# EAGLE design FLCOS Projector Driver (EAGLE 9.0.1)

## Sheet 1 of 3
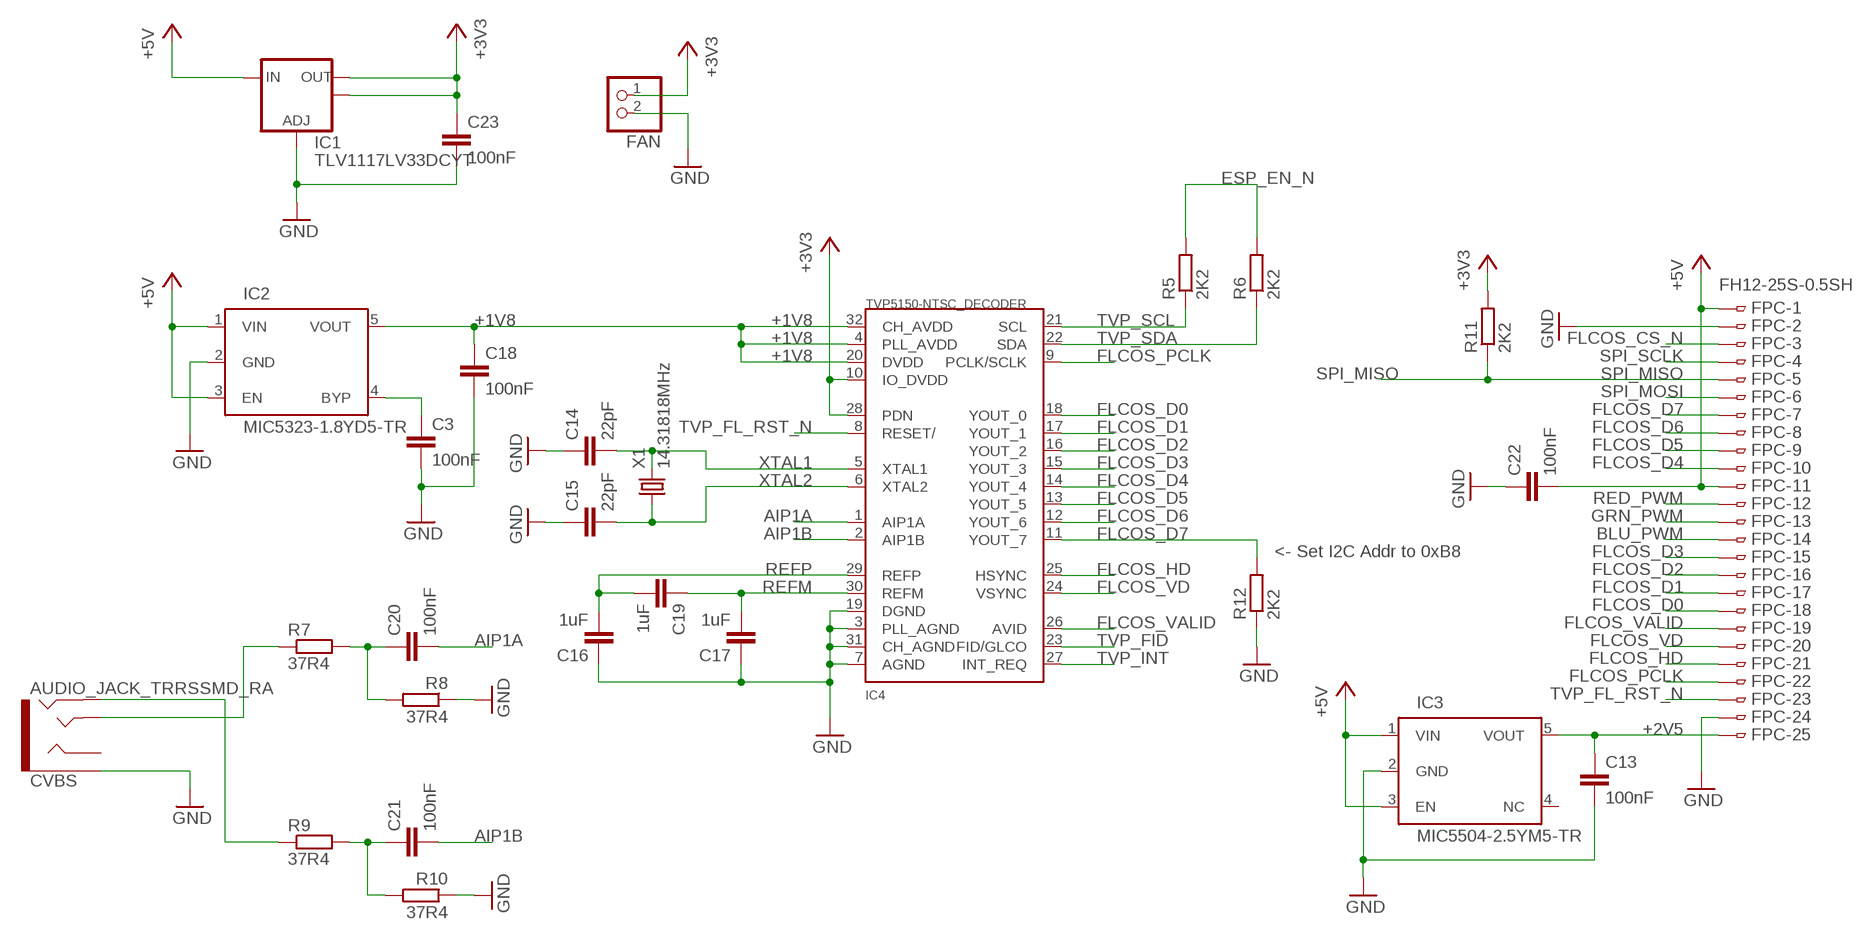
[diagram p0: schematic, sheet 1]

### Parts
C3  100nF  C-EUC0603  [C0603]
C13  100nF  C-EUC0603  [C0603]
C14  22pF  C-EUC0603  [C0603]
C15  22pF  C-EUC0603  [C0603]
C16  1uF  C-EUC0603  [C0603]
C17  1uF  C-EUC0603  [C0603]
C18  100nF  C-EUC0603  [C0603]
C19  1uF  C-EUC0603  [C0603]
C20  100nF  C-EUC0603  [C0603]
C21  100nF  C-EUC0603  [C0603]
C22  100nF  C-EUC0603  [C0603]
C23  100nF  C-EUC0603  [C0603]
CVBS  AUDIO_JACK_TRRSSMD_RA  [AUDIO_JACK_3.5MM_TRRS_SMD_RA]
FAN  JST_2PIN-THM  [JST-PH-2-THM]
FPC  FH12-25S-0.5SH  [FH12-25S-0.5SH]
IC1  TLV1117LV33DCYT  V_REG_LM1117SOT223  [SOT223]
IC2  MIC5323-1.8YD5-TR  [SOT23-5]
IC3  MIC5504-2.5YM5-TR  [SOT23-5]
IC4  TVP5150-NTSC_DECODER  [TQFP32-5MM]
R5  2K2  R-EU_R0603  [R0603]
R6  2K2  R-EU_R0603  [R0603]
R7  37R4  R-EU_R0603  [R0603]
R8  37R4  R-EU_R0603  [R0603]
R9  37R4  R-EU_R0603  [R0603]
R10  37R4  R-EU_R0603  [R0603]
R11  2K2  R-EU_R0603  [R0603]
R12  2K2  R-EU_R0603  [R0603]
X1  14.31818MHz  CRYSTALCTS406  [CTS406]

### Nets
+1V8: C18.1 IC2.5(VOUT) IC4.4(PLL_AVDD) IC4.20(DVDD) IC4.32(CH_AVDD)
+2V5: C13.1 FPC.25 IC3.5(VOUT)
+3V3: C23.1 FAN.1 IC1.2(OUT) IC1.4(OUT) IC4.10(IO_DVDD) IC4.28(PDN) R11.2 ; also sheet 2,3
+5V: C22.2 FPC.1 FPC.11 IC1.3(IN) IC2.1(VIN) IC2.3(EN) IC3.1(VIN) IC3.3(EN) ; also sheet 2,3
AIP1A: C20.2 IC4.1(AIP1A)
AIP1B: C21.2 IC4.2(AIP1B)
BLU_PWM: FPC.14 ; also sheet 3
ESP_EN_N: R5.2 R6.2 ; also sheet 2
FLCOS_CS_N: FPC.3 ; also sheet 2
FLCOS_D0: FPC.18 IC4.18(YOUT_0) ; also sheet 2
FLCOS_D1: FPC.17 IC4.17(YOUT_1) ; also sheet 2
FLCOS_D2: FPC.16 IC4.16(YOUT_2) ; also sheet 2
FLCOS_D3: FPC.15 IC4.15(YOUT_3) ; also sheet 2
FLCOS_D4: FPC.10 IC4.14(YOUT_4) ; also sheet 2
FLCOS_D5: FPC.9 IC4.13(YOUT_5) ; also sheet 2
FLCOS_D6: FPC.8 IC4.12(YOUT_6) ; also sheet 2
FLCOS_D7: FPC.7 IC4.11(YOUT_7) R12.2 ; also sheet 2
FLCOS_HD: FPC.21 IC4.25(HSYNC) ; also sheet 2
FLCOS_PCLK: FPC.22 IC4.9(PCLK/SCLK) ; also sheet 2
FLCOS_VALID: FPC.19 IC4.26(AVID) ; also sheet 2
FLCOS_VD: FPC.20 IC4.24(VSYNC) ; also sheet 2
GND: C3.2 C13.2 C14.1 C15.1 C16.1 C17.1 C18.2 C22.1 C23.2 CVBS.EARTH FAN.2 FPC.2 FPC.24 IC1.1(ADJ) IC2.2(GND) IC3.2(GND) IC4.3(PLL_AGND) IC4.7(AGND) IC4.19(DGND) IC4.31(CH_AGND) R8.1 R10.1 R12.1 ; also sheet 2,3
GRN_PWM: FPC.13 ; also sheet 3
N$10: C3.1 IC2.4(BYP)
N$15: C21.1 R9.2 R10.2
N$17: C20.1 R7.2 R8.2
N$20: CVBS.TIP R7.1
N$21: CVBS.RING2 R9.1
RED_PWM: FPC.12 ; also sheet 3
REFM: C17.2 C19.1 IC4.30(REFM)
REFP: C16.2 C19.2 IC4.29(REFP)
SPI_MISO: FPC.5 R11.1 ; also sheet 2
SPI_MOSI: FPC.6 ; also sheet 2
SPI_SCLK: FPC.4 ; also sheet 2
TVP_FID: IC4.23(FID/GLCO) ; also sheet 2
TVP_FL_RST_N: FPC.23 IC4.8(RESET/) ; also sheet 2
TVP_INT: IC4.27(INT_REQ) ; also sheet 2
TVP_SCL: IC4.21(SCL) R5.1 ; also sheet 2
TVP_SDA: IC4.22(SDA) R6.1 ; also sheet 2
XTAL1: C14.2 IC4.5(XTAL1) X1.3
XTAL2: C15.2 IC4.6(XTAL2) X1.1
Unconnected: CVBS.RING1 IC3.4(NC)

### Notes on the sheet
- <- Set I2C Addr to 0xB8

## Sheet 2 of 3
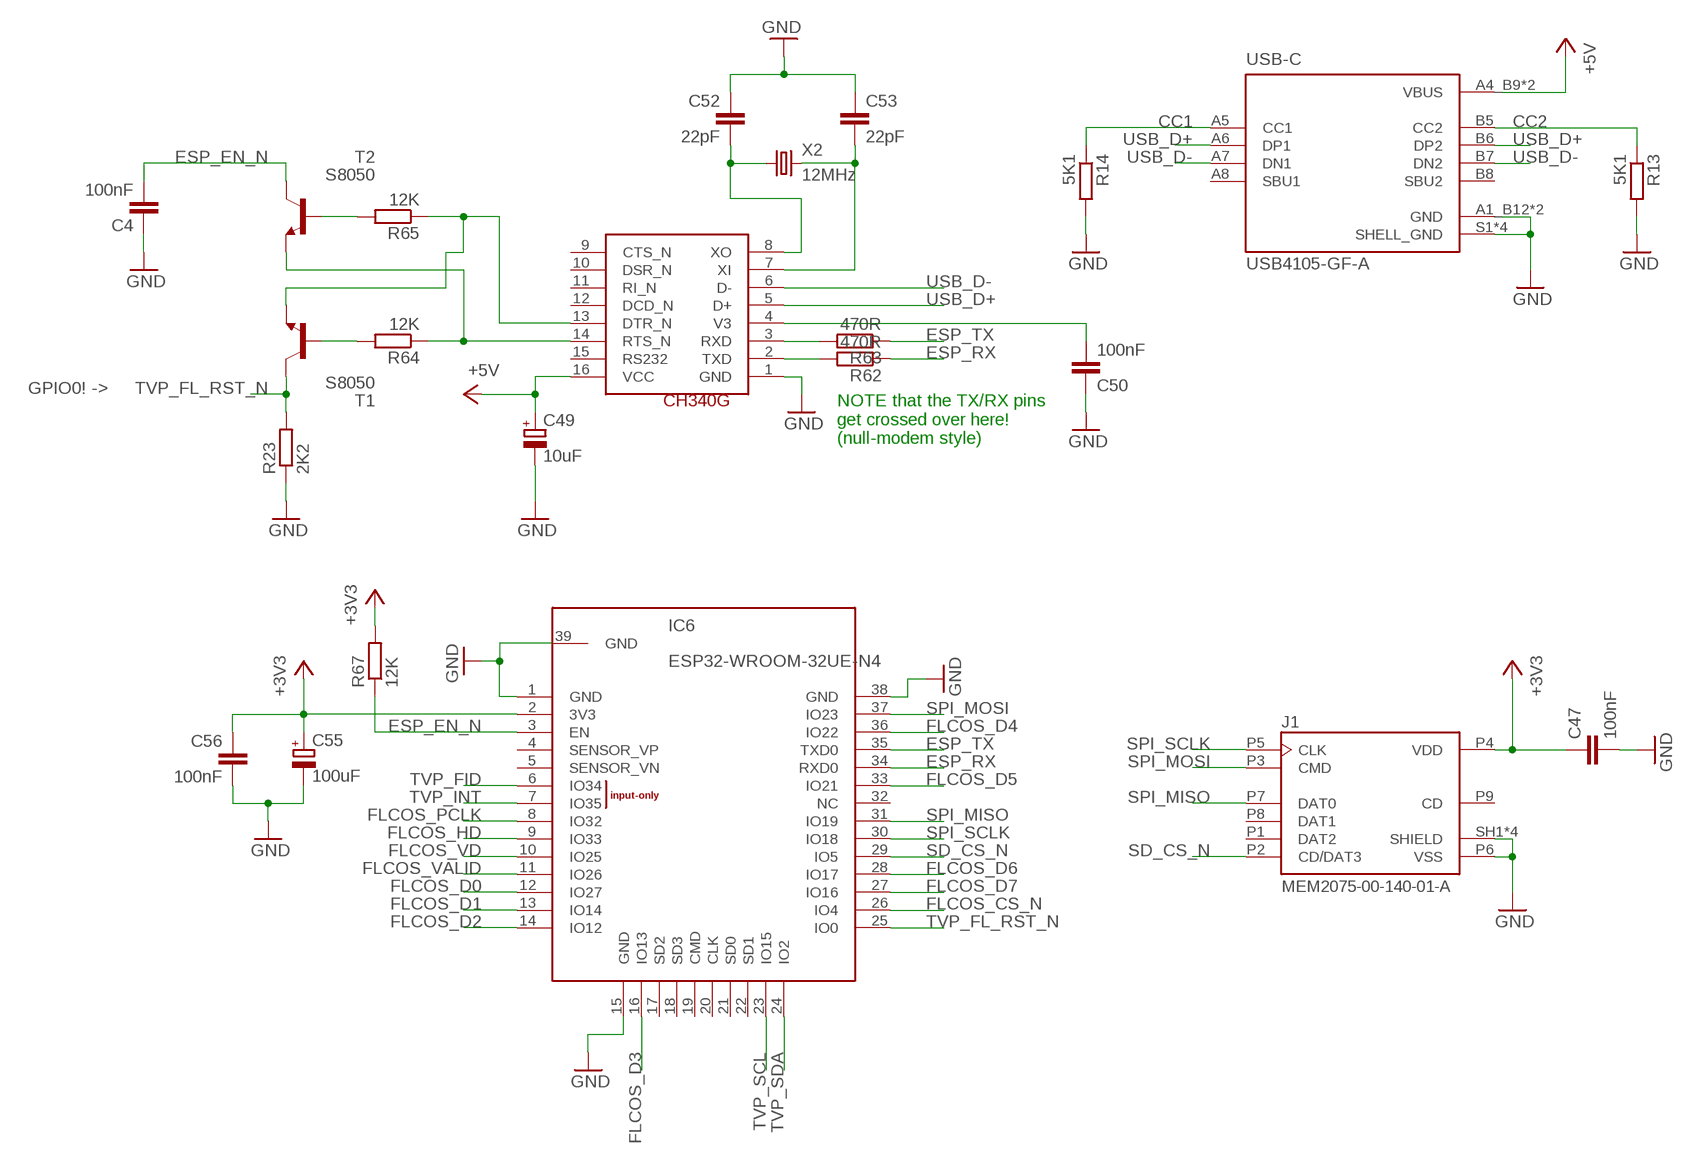
[diagram p1: schematic, sheet 2]

### Parts
C4  100nF  C-EUC0603  [C0603]
C47  100nF  C-EUC0603  [C0603]
C49  10uF  CPOL-EUB/3528-21W  [B/3528-21W]
C50  100nF  C-EUC0603  [C0603]
C52  22pF  C-EUC0603  [C0603]
C53  22pF  C-EUC0603  [C0603]
C55  100uF  CPOL-EUC/6032-28R  [C/6032-28R]
C56  100nF  C-EUC0603  [C0603]
IC5  CH340G  [SOIC16]
IC6  ESP32-WROOM-32UE-N4  ESP32-WROOM-32U  [ESP32WROOM32D]
J1  MEM2075-00-140-01-A  [GCT_MEM2075-00-140-01-A]
R13  5K1  R-EU_R0603  [R0603]
R14  5K1  R-EU_R0603  [R0603]
R23  2K2  R-EU_R0603  [R0603]
R62  470R  R-EU_R0603  [R0603]
R63  470R  R-EU_R0603  [R0603]
R64  12K  R-EU_R0603  [R0603]
R65  12K  R-EU_R0603  [R0603]
R67  12K  R-EU_R0603  [R0603]
T1  S8050  BC849SMD  [SOT23-BEC]
T2  S8050  BC849SMD  [SOT23-BEC]
USB-C  USB4105-GF-A  [GCT_USB4105-GF-A]
X2  12MHz  CRYSTALCTS406  [CTS406]

### Nets
+3V3: C47.1 C55.+ C56.1 IC6.2(3V3) J1.P4(VDD) R67.2 ; also sheet 1,3
+5V: C49.+ IC5.16(VCC) USB-C.A4_B9(VBUS) USB-C.B4_A9(VBUS) ; also sheet 1,3
CC1: R14.1 USB-C.A5(CC1)
CC2: R13.1 USB-C.B5(CC2)
ESP_EN_N: C4.2 IC6.3(EN) R67.1 T2.C ; also sheet 1
ESP_RX: IC6.34(RXD0) R62.1
ESP_TX: IC6.35(TXD0) R63.1
FLCOS_CS_N: IC6.26(IO4) ; also sheet 1
FLCOS_D0: IC6.12(IO27) ; also sheet 1
FLCOS_D1: IC6.13(IO14) ; also sheet 1
FLCOS_D2: IC6.14(IO12) ; also sheet 1
FLCOS_D3: IC6.16(IO13) ; also sheet 1
FLCOS_D4: IC6.36(IO22) ; also sheet 1
FLCOS_D5: IC6.33(IO21) ; also sheet 1
FLCOS_D6: IC6.28(IO17) ; also sheet 1
FLCOS_D7: IC6.27(IO16) ; also sheet 1
FLCOS_HD: IC6.9(IO33) ; also sheet 1
FLCOS_PCLK: IC6.8(IO32) ; also sheet 1
FLCOS_VALID: IC6.11(IO26) ; also sheet 1
FLCOS_VD: IC6.10(IO25) ; also sheet 1
GND: C4.1 C47.2 C49.- C50.1 C52.1 C53.1 C55.- C56.2 IC5.1(GND) IC6.1(GND) IC6.15(GND) IC6.38(GND) IC6.39(GND) J1.P6(VSS) J1.SH1(SHIELD) J1.SH2(SHIELD) J1.SH3(SHIELD) J1.SH4(SHIELD) R13.2 R14.2 R23.1 USB-C.A1_B12(GND) USB-C.B1_A12(GND) USB-C.S1(SHELL_GND) USB-C.S2(SHELL_GND) USB-C.S3(SHELL_GND) USB-C.S4(SHELL_GND) ; also sheet 1,3
N$67: IC5.2(TXD) R62.2
N$70: IC5.3(RXD) R63.2
N$71: R64.2 T1.B
N$77: R65.2 T2.B
N$78: IC5.14(RTS_N) R64.1 T2.E
N$79: IC5.13(DTR_N) R65.1 T1.E
N$80: C50.2 IC5.4(V3)
N$81: C53.2 IC5.7(XI) X2.3
N$82: C52.2 IC5.8(XO) X2.1
SD_CS_N: IC6.29(IO5) J1.P2(CD/DAT3)
SPI_MISO: IC6.31(IO19) J1.P7(DAT0) ; also sheet 1
SPI_MOSI: IC6.37(IO23) J1.P3(CMD) ; also sheet 1
SPI_SCLK: IC6.30(IO18) J1.P5(CLK) ; also sheet 1
TVP_FID: IC6.6(IO34) ; also sheet 1
TVP_FL_RST_N: IC6.25(IO0) R23.2 T1.C ; also sheet 1
TVP_INT: IC6.7(IO35) ; also sheet 1
TVP_SCL: IC6.23(IO15) ; also sheet 1
TVP_SDA: IC6.24(IO2) ; also sheet 1
USB_D+: IC5.5(D+) USB-C.A6(DP1) USB-C.B6(DP2)
USB_D-: IC5.6(D-) USB-C.A7(DN1) USB-C.B7(DN2)
Unconnected: IC5.9(CTS_N) IC5.10(DSR_N) IC5.11(RI_N) IC5.12(DCD_N) IC5.15(RS232) IC6.4(SENSOR_VP) IC6.5(SENSOR_VN) IC6.17(SD2) IC6.18(SD3) IC6.19(CMD) IC6.20(CLK) IC6.21(SD0) IC6.22(SD1) IC6.32(NC) J1.P1(DAT2) J1.P8(DAT1) J1.P9(CD) USB-C.A8(SBU1) USB-C.B8(SBU2)

### Notes on the sheet
- GPIO0! ->
- NOTE that the TX/RX pins
  get crossed over here!
  (null-modem style)

## Sheet 3 of 3
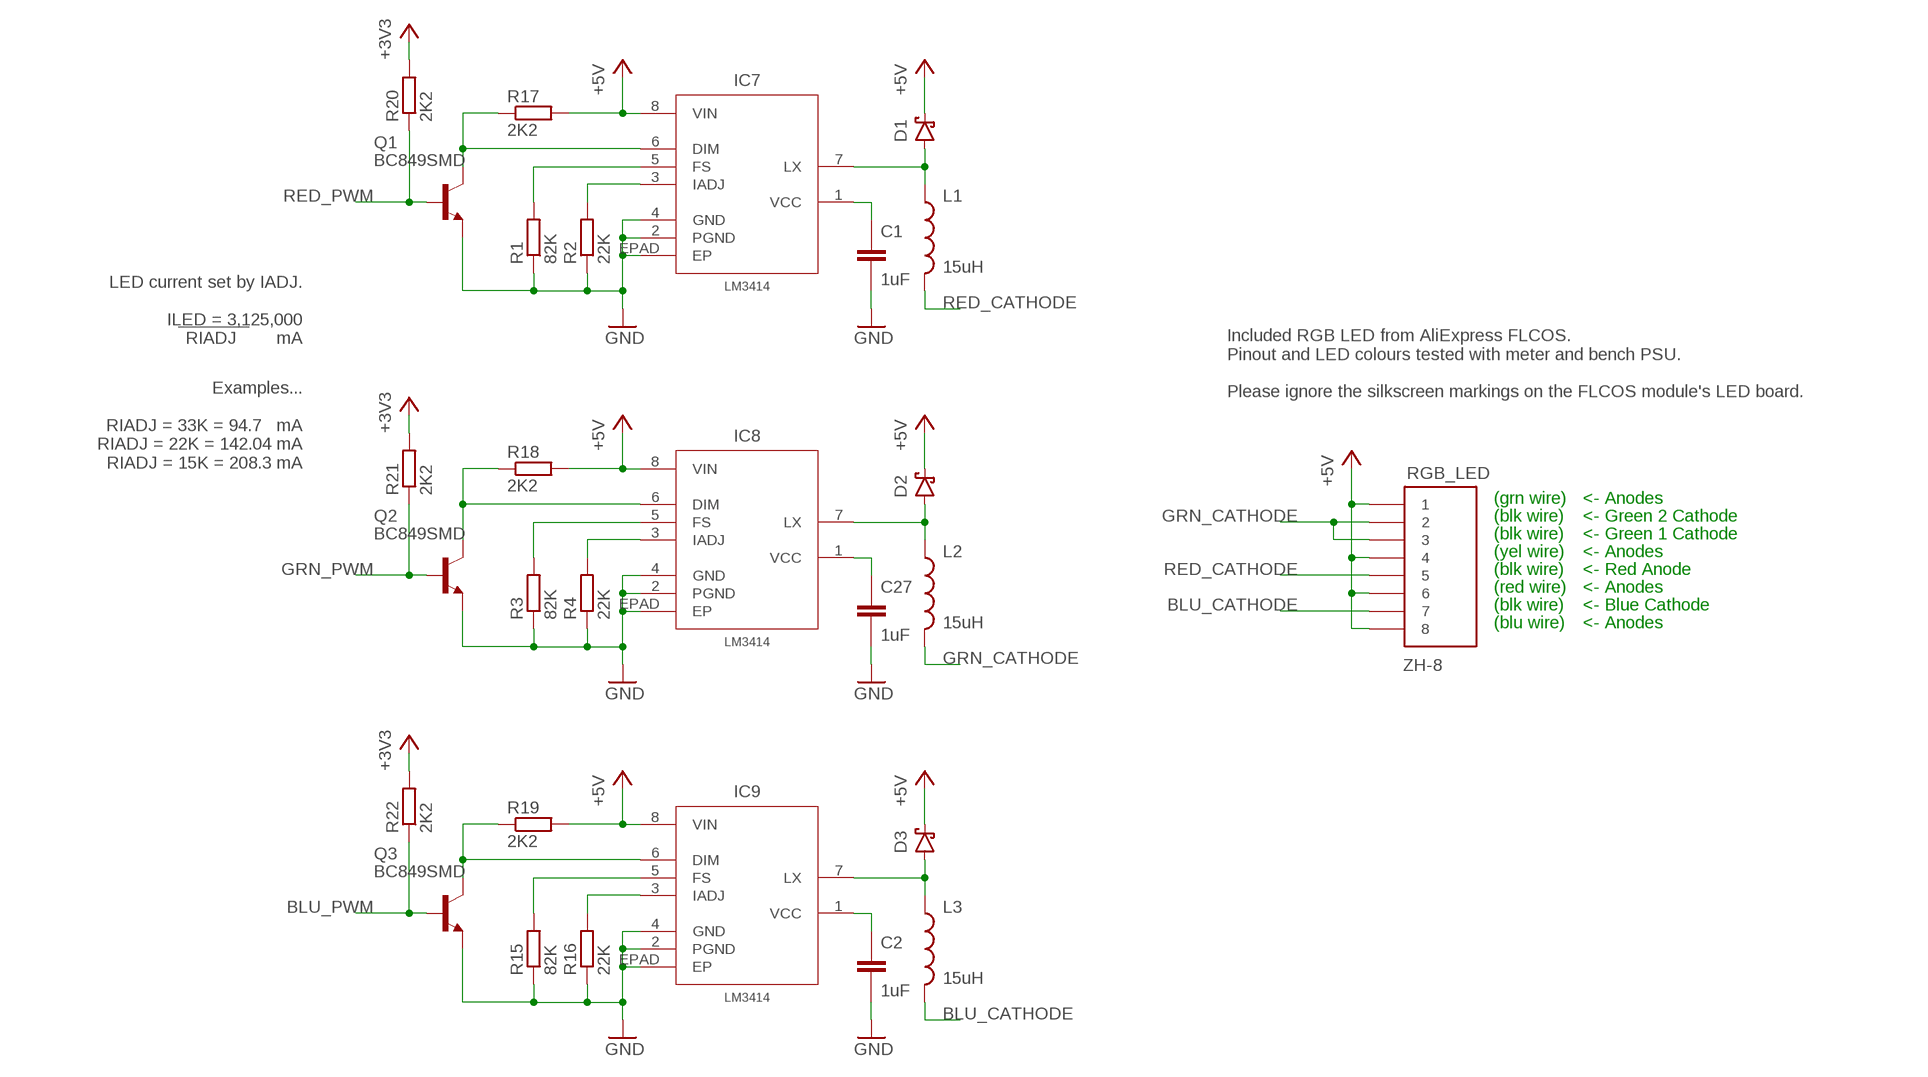
[diagram p2: schematic, sheet 3]

### Parts
C1  1uF  CAPACITOR-CERAMICC0603  [C0603]
C2  1uF  CAPACITOR-CERAMICC0603  [C0603]
C27  1uF  CAPACITOR-CERAMICC0603  [C0603]
D1  "SB34AFC-AU_R1_000A1 SB34AFC-AU_R1_000A1"  DIODE-SCHOTTKYSMA  [SMA-DIODE-SCHOTTKY]
D2  "SB34AFC-AU_R1_000A1 SB34AFC-AU_R1_000A1"  DIODE-SCHOTTKYSMA  [SMA-DIODE-SCHOTTKY]
D3  "SB34AFC-AU_R1_000A1 SB34AFC-AU_R1_000A1"  DIODE-SCHOTTKYSMA  [SMA-DIODE-SCHOTTKY]
IC7  LM3414  LM3414SO08-PAD  [SO08-PAD]
IC8  LM3414  LM3414SO08-PAD  [SO08-PAD]
IC9  LM3414  LM3414SO08-PAD  [SO08-PAD]
L1  15uH  INDUCTOR-TAIYO-YUDEN-6X2.8  [TAIYO-YUDEN-6X6X2.8]
L2  15uH  INDUCTOR-TAIYO-YUDEN-6X2.8  [TAIYO-YUDEN-6X6X2.8]
L3  15uH  INDUCTOR-TAIYO-YUDEN-6X2.8  [TAIYO-YUDEN-6X6X2.8]
Q1  BC849SMD  [SOT23-BEC]
Q2  BC849SMD  [SOT23-BEC]
Q3  BC849SMD  [SOT23-BEC]
R1  82K  R-EU_R0603  [R0603]
R2  22K  R-EU_R0603  [R0603]
R3  82K  R-EU_R0603  [R0603]
R4  22K  R-EU_R0603  [R0603]
R15  82K  R-EU_R0603  [R0603]
R16  22K  R-EU_R0603  [R0603]
R17  2K2  R-EU_R0603  [R0603]
R18  2K2  R-EU_R0603  [R0603]
R19  2K2  R-EU_R0603  [R0603]
R20  2K2  R-EU_R0603  [R0603]
R21  2K2  R-EU_R0603  [R0603]
R22  2K2  R-EU_R0603  [R0603]
RGB_LED  ZH-8  [ZH-8]

### Nets
+3V3: R20.2 R21.2 R22.2 ; also sheet 1,2
+5V: D1.C D2.C D3.C IC7.8(VIN) IC8.8(VIN) IC9.8(VIN) R17.2 R18.2 R19.2 RGB_LED.1 RGB_LED.4 RGB_LED.6 RGB_LED.8 ; also sheet 1,2
BLU_CATHODE: L3.2 RGB_LED.7
BLU_PWM: Q3.B R22.1 ; also sheet 1
GND: C1.2 C2.2 C27.2 IC7.2(PGND) IC7.4(GND) IC7.EPAD(EP) IC8.2(PGND) IC8.4(GND) IC8.EPAD(EP) IC9.2(PGND) IC9.4(GND) IC9.EPAD(EP) Q1.E Q2.E Q3.E R1.1 R2.1 R3.1 R4.1 R15.1 R16.1 ; also sheet 1,2
GRN_CATHODE: L2.2 RGB_LED.2 RGB_LED.3
GRN_PWM: Q2.B R21.1 ; also sheet 1
N$1: IC7.6(DIM) Q1.C R17.1
N$2: IC7.3(IADJ) R2.2
N$3: IC7.5(FS) R1.2
N$4: C1.1 IC7.1(VCC)
N$5: D1.A IC7.7(LX) L1.1
N$6: IC9.3(IADJ) R16.2
N$7: IC9.5(FS) R15.2
N$8: C2.1 IC9.1(VCC)
N$9: D3.A IC9.7(LX) L3.1
N$11: IC8.6(DIM) Q2.C R18.1
N$12: IC9.6(DIM) Q3.C R19.1
N$24: IC8.3(IADJ) R4.2
N$25: IC8.5(FS) R3.2
N$26: C27.1 IC8.1(VCC)
N$27: D2.A IC8.7(LX) L2.1
RED_CATHODE: L1.2 RGB_LED.5
RED_PWM: Q1.B R20.1 ; also sheet 1

### Notes on the sheet
- LED current set by IADJ.
  
  ILED = 3,125,000
                RIADJ        mA
- Included RGB LED from AliExpress FLCOS.
  Pinout and LED colours tested with meter and bench PSU.
  
  Please ignore the silkscreen markings on the FLCOS module's LED board.
- Examples...
  
  RIADJ = 33K = 94.7   mA
  RIADJ = 22K = 142.04 mA
  RIADJ = 15K = 208.3 mA
- (grn wire) | <- Anodes
- (blk wire) | <- Green 2 Cathode
- (blk wire) | <- Green 1 Cathode
- (yel wire) | <- Anodes
- (blk wire) | <- Red Anode
- (red wire) | <- Anodes
- (blk wire) | <- Blue Cathode
- (blu wire) | <- Anodes

## Library data of the parts
C1 C2 C27 = A_butts:CAPACITOR-CERAMIC: CAPACITOR, European symbol
C3 C4 C13-C23 C47 C50 C52 C53 C56 = rcl:C-EU: CAPACITOR, European symbol
C49 C55 = rcl:CPOL-EU: POLARIZED CAPACITOR, European symbol
CVBS = SparkFun-Connectors:AUDIO_JACK_TRRS: Audio Jack - 3.5mm TRRS (SMD) This is a 3.5mm TRRS SMD audio jack. TRRS connectors are the audio-style connectors that you see on some phones, MP3 players and development boards. TRRS stands for “tip, ring, ring, sleeve,” which reflects that this has three conductors and a ground. SparkFun Products: Audio Jack <https://www.sparkfun.com/products/12639> mbed Starter Kit <https://www.sparkfun.com/products/12968> SparkFun TRRS 3.5mm Jack Breakout <https://www.sparkfun.com/products/11570>; PROD_ID: CONN-10676; SF_ID: PRT-12639
D1-D3 = A_butts:DIODE-SCHOTTKY: Schottky diodes in SFE's production catalog BAT20J 1A 23V 0.62Vf RB751 120mA 40V 0.37Vf PMEG4005EJ 0.5A 40V 0.42Vf MBRA140 1A 40V 0.5Vf B340A 3A 40V SMA
FAN = adafruit:JST_2PIN: JST 2-Pin Connectors of various flavors SMT-RA (S2B-PH-SM4) 4UConnector #17311 SMT (B2B-PH-SM4) THM-RA (S2B-PH) THM (B2B-PH)
FPC = con-hirose:FH12-25S-0.5S: 0.5mm Pitch Connectors For FPC/FFC Source: Data sheet <http://www.hirose.co.jp/cataloge_hp/e58605370.pdf>; OC_FARNELL: unknown; OC_NEWARK: unknown
IC1 = SparkFun:V_REG_LM1117: Voltage Regulator LM1117 Standard adjustable voltage regulator but in SMD form. Spark Fun Electronics SKU : COM-00595
IC2 = v-reg-micrel:MIC5323-1.8YD5-TR
IC3 = v-reg-micrel:MIC5504-2.5YM5-TR
IC4 = SparkFun-AnalogIC:TVP5150-NTSC_DECODER: Texas Instrument NTSC/PAL Decoder TI Part #TVP5150AM1 *** UNPROVEN FOOTPRINT *** Decodes NTSC video signal to YCbCr 4:2:2 signal
IC5 = usb-serial:CH340G
IC6 = ESP32-WROOM-32U:ESP32-WROOM-32U: WiFi Modules (802.11) SMD Module, ESP32-D0WD, 32Mbits SPI flash, UART mode, U.FL antenna connector Source: Datasheet <https://www.mouser.de/datasheet/2/891/esp32-wroom-32d_esp32-wroom-32u_datasheet_en-1365844.pdf>; DESCRIPTION: WiFi Modules (802.11) SMD Module, ESP32-D0WD, 32Mbits SPI flash, UART mode, U.FL antenna connector; HEIGHT: 3.1mm; MANUFACTURER_NAME: Espressif; MANUFACTURER_PART_NUMBER: ESP32-WROOM-32U; MOUSER_PART_NUMBER: 356-ESP32-WROOM-32U
IC7-IC9 = A_butts:LM3414
J1 = MEM2075-00-140-01-A:MEM2075-00-140-01-A: Micro SD Memory Card Connector, 1.4mm Profile SMT, Push-Push, with Normally open Switch Check availability <https://pricing.snapeda.com/parts/MEM2075-00-140-01-A/Global%20Connector%20Technology/view-part?ref=eda>; AVAILABILITY: In Stock; DESCRIPTION: 9 (8 + 1) Position Card Connector microSD Surface Mount, Right Angle Gold; MF: Global Connector Technology; MP: MEM2075-00-140-01-A; PACKAGE: None; PRICE: None; PURCHASE-URL: https://pricing.snapeda.com/search/part/MEM2075-00-140-01-A/?ref=eda
L1-L3 = A_butts:INDUCTOR: Inductors Basic Inductor/Choke - 0603 and 1206. Footprints are not proven and vary greatly between part numbers. SRN6045- 33uH, 20% 1.4A SDR0403-560KL - 56uH, 10%, 500mA RMS/740mA peak
Q1-Q3 T1 T2 = transistor-npn:BC849*: NPN Transistor
R1-R23 R62-R65 R67 = rcl:R-EU_: RESISTOR, European symbol
RGB_LED = con-jst:ZH-8
USB-C = USB4105-GF-A:USB4105-GF-A: USB-C (USB TYPE-C) USB 2.0 Receptacle Connector 24 (16+8 Dummy) Position Surface Mount, Right Angle; Through Hole Check availability <https://pricing.snapeda.com/parts/USB4105-GF-A/GCT/view-part?ref=eda>; AVAILABILITY: In Stock; DESCRIPTION: USB-C (USB TYPE-C) USB 2.0 Receptacle Connector 24 (16+8 Dummy) Position Surface Mount, Right Angle; Through Hole; MF: GCT; MP: USB4105-GF-A; PACKAGE: None; PRICE: None; PURCHASE-URL: https://pricing.snapeda.com/search/part/USB4105-GF-A/?ref=eda
X1 X2 = crystal:CRYSTAL: CRYSTAL; OC_FARNELL: unknown; OC_NEWARK: unknown

## Board
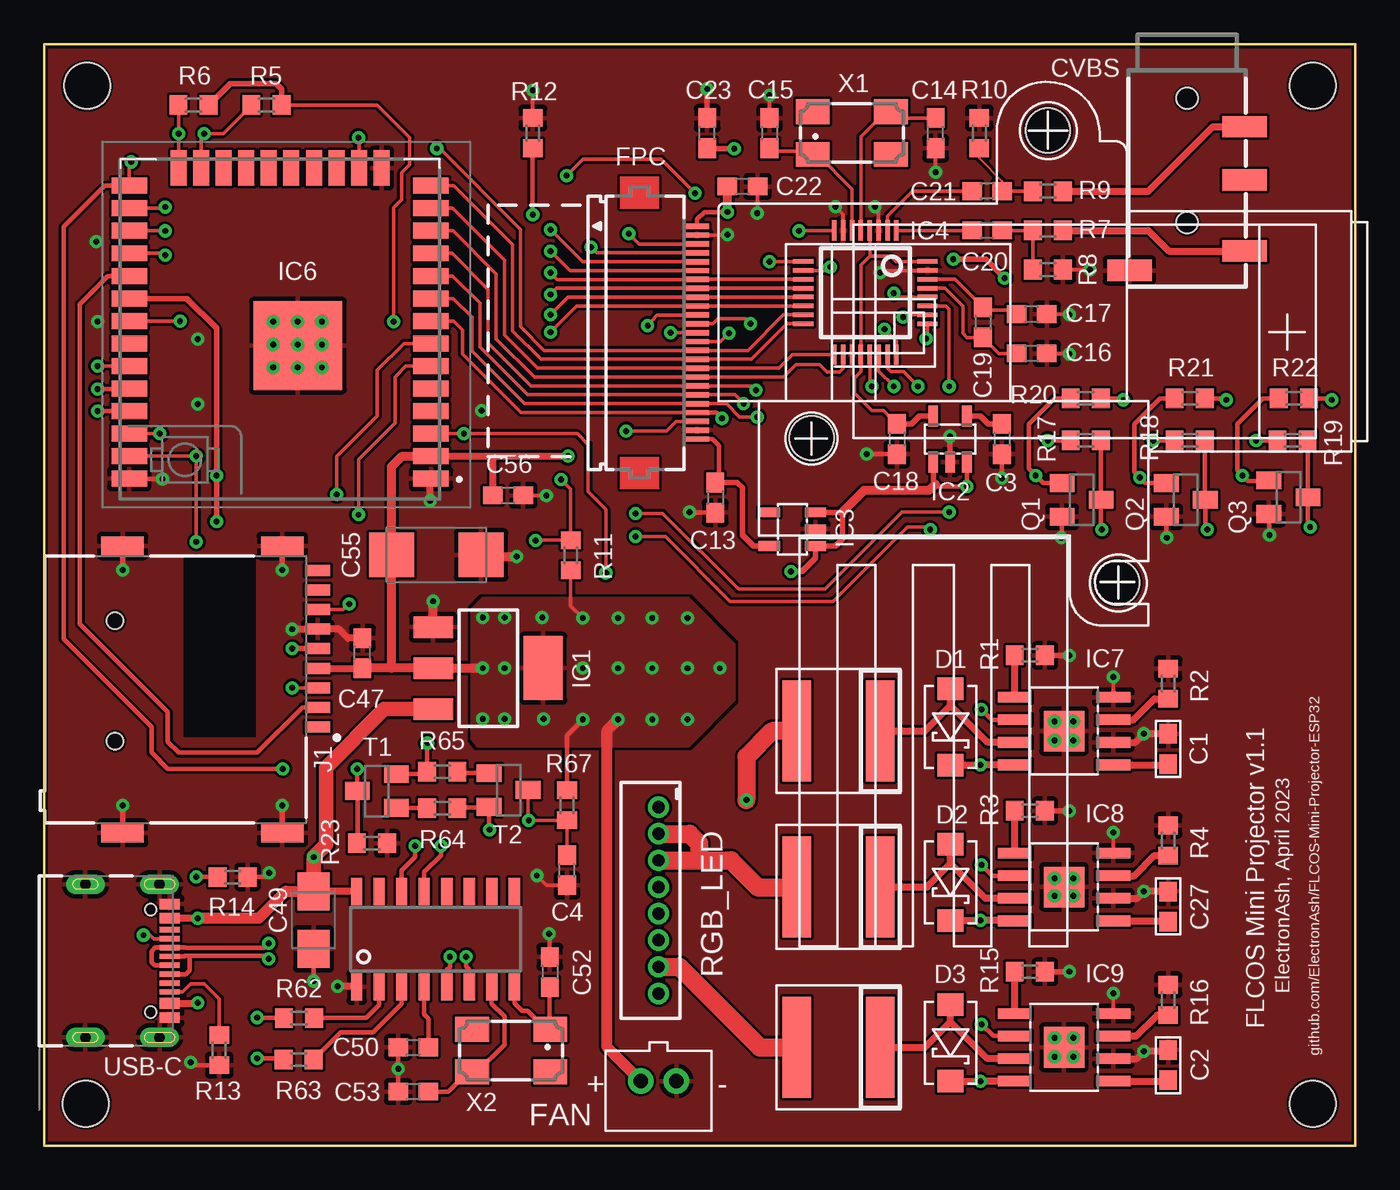
[diagram p3: board, top side]
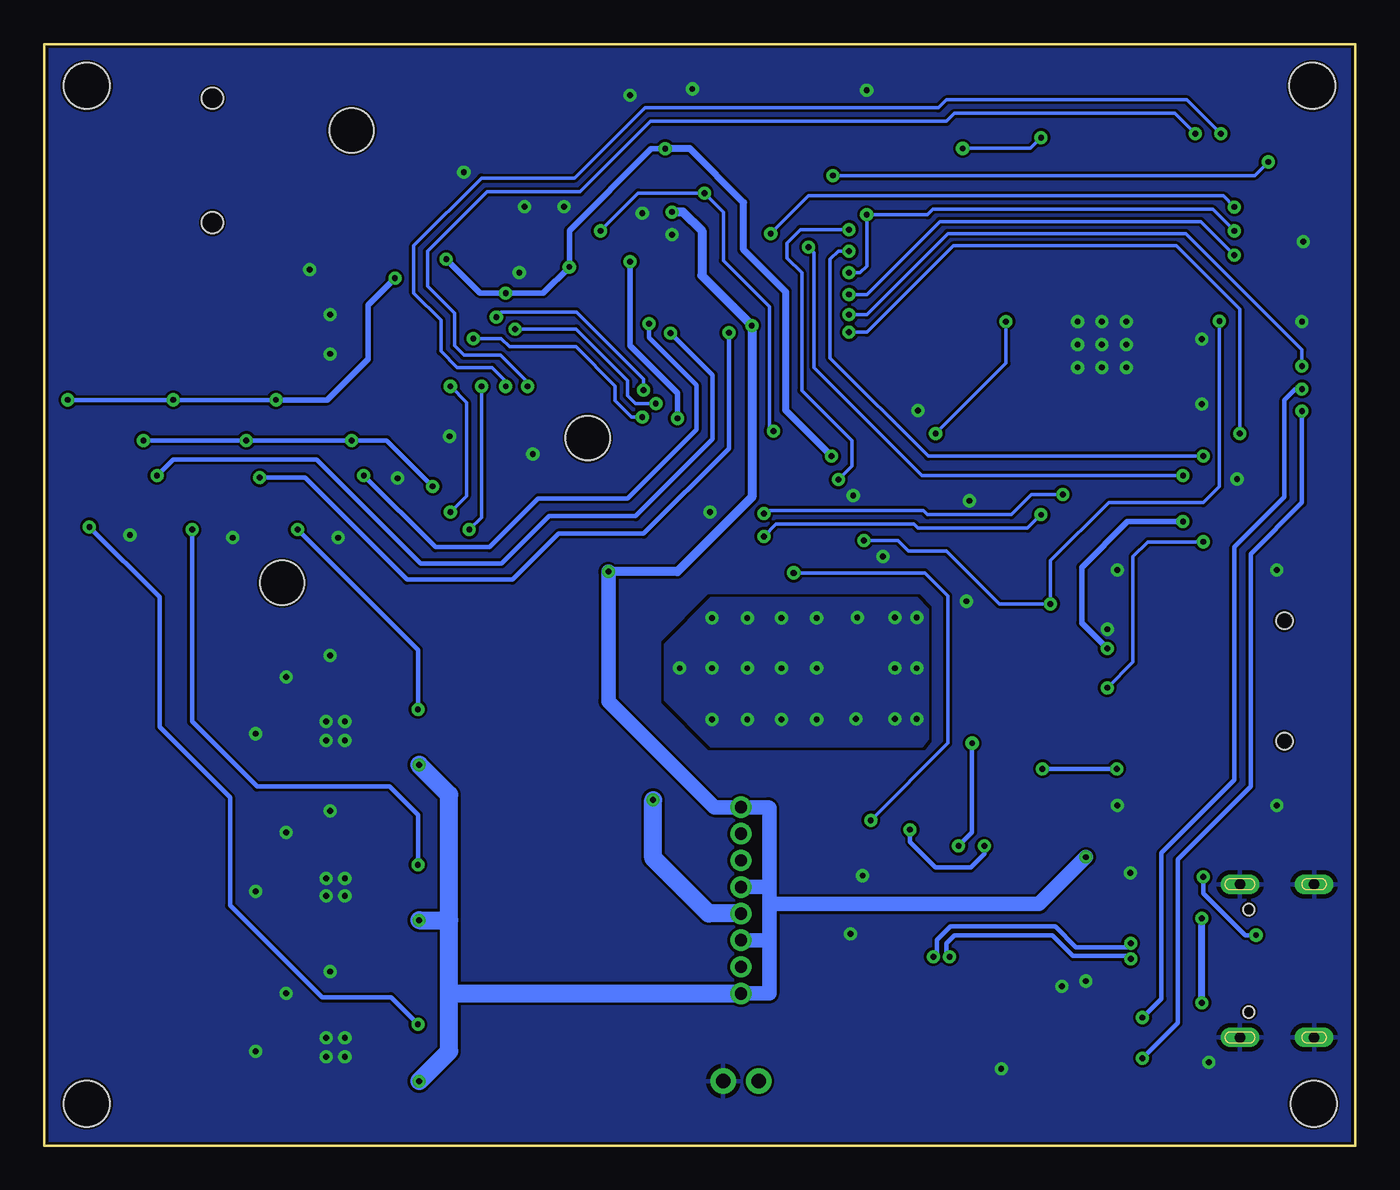
[diagram p4: board, bottom side, seen from below]

Size 73.89 x 62.08 mm. Coordinates in mm from the lower left corner, seen from the top.
Outline: 0,62.08 73.89,62.08 73.89,0 0,0 0,62.08
Copper layers (1*16): Top 0.035mm / dielectric 1.5mm / Bottom 0.035mm
Design rules "default *": minimum track width 6mil, minimum drill 13mil, track to track 6mil, track to pad 6mil, pad to pad 6mil, via to via 6mil, smd to smd 6mil, copper to edge 6mil, drill to drill 6mil, minimum pad ring 10mil, minimum via ring 8mil, stop-mask expansion 4mil, vias tented up to drill 25mil, thermal gap 10mil
Holes 2.5 mm at 56.57,57.23 43.26,39.88 60.48,31.72
Holes 2.6 mm at 2.41,59.74 71.5,59.74 2.34,2.36 71.5,2.36

### Footprints (pad centres in the part's own frame; a part is rotated, then mirrored left to right if it is on the bottom)
C0603 = smd 1.1 x 1: 1 -0.85,0; 2 0.85,0
B/3528-21W = smd 2.15 x 1.8: + 1.625,0; - -1.625,0
C/6032-28R = smd 2.55 x 2.5: + 2.525,0; - -2.525,0
AUDIO_JACK_3.5MM_TRRS_SMD_RA = smd 1.2 x 2.5: EARTH 11.3,-3.25; RING1 6.2,3.25; RING2 3.2,3.25; TIP 10.2,3.25 | hole 1.2: 1.6,0; 8.6,0
SMA-DIODE-SCHOTTKY = smd 1.27 x 1.47: A -2.15,0; C 2.15,0
JST-PH-2-THM = drill 0.8 pad 1.422: 1 1,0; 2 -1,0
FH12-25S-0.5SH = smd 0.3 x 1.3: 1 -6,3.25; 2 -5.5,3.25; 3 -5,3.25; 4 -4.5,3.25; 5 -4,3.25; 6 -3.5,3.25; 7 -3,3.25; 8 -2.5,3.25; 9 -2,3.25; 10 -1.5,3.25; 11 -1,3.25; 12 -0.5,3.25; 13 0,3.25; 14 0.5,3.25; 15 1,3.25; 16 1.5,3.25; 17 2,3.25; 18 2.5,3.25; 19 3,3.25; 20 3.5,3.25; 21 4,3.25; 22 4.5,3.25; 23 5,3.25; 24 5.5,3.25; 25 6,3.25
SOT223 = smd 1.219 x 2.235: 1 -2.311,-3.099; 2 0,-3.099; 3 2.311,-3.099 | smd 3.6 x 2.2: 4 0,3.099
SOT23-5 = smd 0.55 x 1.2: 1 -0.95,-1.3; 2 0,-1.3; 3 0.95,-1.3; 4 0.95,1.3; 5 -0.95,1.3
TQFP32-5MM = smd 1.143 x 0.254: 1 -3.5,1.75; 2 -3.5,1.25; 3 -3.5,0.75; 4 -3.5,0.25; 5 -3.5,-0.25; 6 -3.5,-0.75; 7 -3.5,-1.25; 8 -3.5,-1.75; 17 3.5,-1.75; 18 3.5,-1.25; 19 3.5,-0.75; 20 3.5,-0.25; 21 3.5,0.25; 22 3.5,0.75; 23 3.5,1.25; 24 3.5,1.75 | smd 0.254 x 1.143: 9 -1.75,-3.5; 10 -1.25,-3.5; 11 -0.75,-3.5; 12 -0.25,-3.5; 13 0.25,-3.5; 14 0.75,-3.5; 15 1.25,-3.5; 16 1.75,-3.5; 25 1.75,3.5; 26 1.25,3.5; 27 0.75,3.5; 28 0.25,3.5; 29 -0.25,3.5; 30 -0.75,3.5; 31 -1.25,3.5; 32 -1.75,3.5
SOIC16 = smd 0.635 x 1.524: 1 -4.445,-2.695; 2 -3.175,-2.695; 3 -1.905,-2.695; 4 -0.635,-2.695; 5 0.635,-2.695; 6 1.905,-2.695; 7 3.175,-2.695; 8 4.445,-2.695; 9 4.445,2.695; 10 3.175,2.695; 11 1.905,2.695; 12 0.635,2.695; 13 -0.635,2.695; 14 -1.905,2.695; 15 -3.175,2.695; 16 -4.445,2.695
ESP32WROOM32D = smd 2 x 0.9: 1 -8.15,5.51; 2 -8.15,4.24; 3 -8.15,2.97; 4 -8.15,1.7; 5 -8.15,0.43; 6 -8.15,-0.84; 7 -8.15,-2.11; 8 -8.15,-3.38; 9 -8.15,-4.65; 10 -8.15,-5.92; 11 -8.15,-7.19; 12 -8.15,-8.46; 13 -8.15,-9.73; 14 -8.15,-11; 25 8.85,-11; 26 8.85,-9.73; 27 8.85,-8.46; 28 8.85,-7.19; 29 8.85,-5.92; 30 8.85,-4.65; 31 8.85,-3.38; 32 8.85,-2.11; 33 8.85,-0.84; 34 8.85,0.43; 35 8.85,1.7; 36 8.85,2.97; 37 8.85,4.24; 38 8.85,5.51 | smd 0.9 x 2: 15 -5.365,-12; 16 -4.095,-12; 17 -2.825,-12; 18 -1.555,-12; 19 -0.285,-12; 20 0.985,-12; 21 2.255,-12; 22 3.525,-12; 23 4.795,-12; 24 6.065,-12 | smd 5 x 5: 39 -0.65,-1.99
SO08-PAD = smd 1.905 x 0.61: 1 -2.781,1.905; 2 -2.781,0.635; 3 -2.781,-0.635; 4 -2.781,-1.905; 5 2.781,-1.905; 6 2.781,-0.635; 7 2.781,0.635; 8 2.781,1.905 | smd 2.286 x 2.286: EPAD 0,0
GCT_MEM2075-00-140-01-A = smd 0.62 x 1.4: P1 2.58,11.42; P2 1.48,11.42; P3 0.38,11.42; P4 -0.72,11.42; P5 -1.82,11.42; P6 -2.92,11.42; P7 -4.02,11.42; P8 -5.12,11.42; P9 -6.22,11.42 | smd 1.1 x 2.4: SH1 -7.6,0.42; SH2 -7.6,9.42; SH3 8.55,9.42; SH4 8.55,0.42 | hole 0.95: -3.4,0; 3.4,0
TAIYO-YUDEN-6X6X2.8 = smd 1.6 x 5.7: 1 0,0; 2 4.7,0
SOT23-BEC = smd 1 x 1.4: B -0.95,-1.1; C 0,1.1; E 0.95,-1.1
R0603 = smd 1 x 1.1: 1 -0.85,0; 2 0.85,0
ZH-8 = drill 0.7 pad 1.1: 1 -4.75,0; 2 -3.25,0; 3 -1.75,0; 4 -0.25,0; 5 1.25,0; 6 2.75,0; 7 4.25,0; 8 5.75,0
GCT_USB4105-GF-A = smd 0.6 x 1.15: A1_B12 -3.2,4.755; A4_B9 -2.4,4.755; B1_A12 3.2,4.755; B4_A9 2.4,4.755 | smd 0.3 x 1.15: A5 -1.25,4.755; A6 -0.25,4.755; A7 0.25,4.755; A8 1.25,4.755; B5 1.75,4.755; B6 0.75,4.755; B7 -0.75,4.755; B8 -1.75,4.755 | drill 0.6 pad 1.05 long: S1 -4.32,4.18; S4 4.32,4.18 | drill 0.6 pad 1 long: S2 -4.32,0; S3 4.32,0 | hole 0.65: 2.89,3.68; -2.89,3.68
CTS406 = smd 1.9 x 1.4: 1 -2.2,-1.2; 2 2.2,-1.2; 3 2.2,1.2; 4 -2.2,1.2

### Placement (x,y rotation side)
C1  63.35,22.36 90 top
C2  63.35,4.54 90 top
C3  53.98,39.83 270 top
C4  29.46,15.52 90 top
C13  37.82,36.53 270 top
C14  50.24,57.07 90 top
C15  40.87,57.07 270 top
C16  55.65,44.65 180 top
C17  55.65,46.86 180 top
C18  48.06,39.83 270 top
C19  52.91,46.41 270 top
C20  53.14,51.59 180 top
C21  53.14,53.8 180 top
C22  39.36,54.06 180 top
C23  37.36,57.07 90 top
C27  63.35,13.47 90 top
C47  17.93,27.76 90 top
C49  15.17,12.71 90 top
C50  20.8,5.54 0 top
C52  28.49,9.79 270 top
C53  20.8,3.04 0 top
C55  22.1,33.3 180 top
C56  26.14,36.65 0 top
CVBS  64.41,60.63 270 top
D1  51.08,23.6 270 top
D2  51.08,14.83 270 top
D3  51.08,5.79 270 top
FAN  34.62,3.63 180 top
FPC  33.55,45.82 270 top
IC1  25.02,26.91 270 top
IC2  51.05,39.83 0 top
IC3  42.16,34.75 90 top
IC4  46.28,48.08 270 top
IC5  22.05,11.63 0 top
IC6  13.64,43.1 180 top
IC7  57.48,23.37 180 top
IC8  57.48,14.58 180 top
IC9  57.48,5.54 180 top
J1  3.99,26.19 270 top
L1  47.12,23.37 180 top
L2  47.12,14.58 180 top
L3  47.12,5.54 180 top
Q1  58.47,36.4 270 top
Q2  64.34,36.4 270 top
Q3  70.13,36.55 270 top
R1  55.55,27.64 180 top
R2  63.35,26.04 270 top
R3  55.55,18.87 180 top
R4  63.35,17.2 270 top
R5  12.52,58.65 0 top
R6  8.41,58.65 0 top
R7  56.57,51.59 180 top
R8  56.57,49.38 180 top
R9  56.57,53.8 180 top
R10  52.71,57.07 270 top
R11  29.67,33.27 270 top
R12  27.53,57.07 270 top
R13  9.86,5.38 270 top
R14  10.62,15.14 0 top
R15  55.55,9.8 180 top
R16  63.35,8.2 270 top
R17  58.7,39.75 180 top
R18  64.57,39.75 180 top
R19  70.36,39.75 180 top
R20  58.7,42.11 0 top
R21  64.57,42.11 0 top
R22  70.43,42.11 0 top
R23  18.47,17.04 180 top
R62  14.35,7.19 0 top
R63  14.34,4.85 0 top
R64  22.43,19.02 180 top
R65  22.43,21.08 0 top
R67  29.46,19.19 90 top
RGB_LED  34.62,14.33 270 top
T1  18.75,19.99 90 top
T2  26.17,20.05 270 top
U$2  [FLCOS_PROJ_OUTLINE]  70.05,45.87 0 top
USB-C  2.31,10.41 270 top
X1  45.52,57.07 0 top
X2  26.31,5.35 180 top

### Tracks (layer width: path | path; a pad name or v marks a point on that pad's centre or on a via)
+1V8
  Top 0.203: C18.1 47.31,41.43 46.66,41.43 45.67,42.42 45.67,43.26 46.03,43.62 IC4.20 46.03,49.64 46.53,50.14 | 46.53,50.14 IC4.4 | IC4.32 48.01,49.83 47.7,50.14 46.53,50.14
  Top 0.305: C18.1 48.88,40.68 49.33,41.13 IC2.5
+2V5
  Top 0.254: FPC.25 37.67,39.82 38.04,39.46 38.04,37.59 C13.1
  Top 0.305: IC3.5 39.96,33.8 39.34,34.42 39.34,37.08 39.05,37.38 C13.1
+3V3  (via drill 0.33)
  Top 0.152: IC4.28 49.02,47.83
  Top 0.203: IC4.10 44.1,49.33 v44.3,49.53 | R11.2 29.67,30.42 v30.35,29.73 | 49.02,47.83 48.1,47.83 v47.88,48.06
  Top 0.254: R67.2 29.46,23.13 v30.35,24.02 | R20.2 60.76,42.11 v60.83,42.04 | v66.62,42.04 66.55,42.11 R21.2 | v72.57,42.04 72.34,42.11 R22.2
  Top 0.305: C23.1 37.39,56.2 v38.89,56.2 | v54.13,48.89 53.06,49.96 v51.23,49.96
  Top 0.406: IC6.2 25.25,38.86 | 25.25,38.86 v29.51,38.86 | C56.1 25.29,38.82 25.25,38.86 | J1.P4 C47.1
  Top 0.508: IC6.2 20.17,38.86 19.57,38.27 C55.+ 19.57,26.91 | v24.71,26.91 IC1.2 19.57,26.91 | 19.57,26.91 C47.1
  Top 0.61: FAN.1 31.72,5.53 31.72,23.41 v32.33,24.02
  Bottom 0.254: v72.57,42.04 v66.62,42.04 v60.83,42.04
  Bottom 0.305: v38.89,56.2 39.68,56.2 44.3,51.59 v44.3,49.53 45.77,48.06 v47.88,48.06 49.33,48.06 v51.23,49.96 | v60.83,42.04 57.94,42.04 55.65,44.32 55.65,47.37 v54.13,48.89
  Bottom 0.406: v29.51,38.86 32.11,41.45 32.11,48.13 34.47,50.5 34.47,53.16 37.51,56.2 v38.89,56.2
  other vias: 28.14,24.05 28.07,29.77 25.93,26.91 30.35,26.91 32.33,26.91 34.26,26.91 36.25,26.91 38.07,26.91 32.33,29.73 34.26,29.73 36.25,29.73 25.93,29.77 25.93,24.05 24.71,24.05 24.71,29.77 34.26,24.02 36.25,24.02
  pour Top: 24.1,22.91 24.1,30.23 24.71,30.84 36.3,30.84 38.89,28.24 38.89,25.12 36.3,22.53 24.41,22.53
  pour Bottom (isolate 0.305): 24.1,22.91 24.1,30.23 24.71,30.84 36.3,30.84 38.89,28.24 38.89,25.12 36.3,22.53 24.41,22.53
+5V  (via drill 0.33)
  Top 0.203: FPC.11 34.53,46.82 v34.01,46.23
  Top 0.254: 36.83,51.85 FPC.1 36.8,52.22 37.21,52.63 v38.51,52.63 | R19.2 v68.3,39.75 | R18.2 v62.51,39.75 | R17.2 v56.57,39.75 | 50.1,37.37 50.32,37.16 v51.99,37.16 v52,37.17 IC2.3
  Top 0.305: IC2.1 50.1,37.37 50.2,37.27 | IC3.3 44.97,35.7 44.98,35.71 44.98,34.19 44.59,33.8 IC3.1 43.46,33.13 42.7,32.36 v42.09,32.36
  Top 0.406: IC5.16 C49.+ | IC8.8 54.67,12.7 v52.76,12.7 52.74,12.68 D2.C | D3.C 51.09,3.63 v52.76,3.63 IC9.8 | D1.C 51.1,21.46 v52.76,21.46 IC7.8 | v8.64,12.81 USB-C.A4_B9 | USB-C.B4_A9 8.6,8.01 v8.64,8.05
  Top 0.508: v38.51,52.63 C22.2 | 50.2,37.27 49.86,36.93 46.2,36.93 44.98,35.71
  Top 0.61: C49.+ 13.61,14.33 12.09,12.81 v8.64,12.81
  Top 0.813: C49.+ v15.17,16.26 15.87,16.97 15.87,21.31 19.16,24.6 IC1.3
  Bottom 0.254: v51.99,37.16 54.58,39.75 v56.57,39.75 v62.51,39.75 v68.3,39.75
  Bottom 0.406: v8.64,8.05 v8.64,12.81
  Bottom 0.508: v38.51,52.63 37.9,52.63 36.83,51.56 36.83,49.05 v34.01,46.23 34.01,36.55 38.2,32.36 v42.09,32.36
  Bottom 0.813: 33.02,13.61 33.02,11.56 | 33.02,11.56 33.02,8.59 33.03,8.58 RGB_LED.8 | 33.02,13.61 33.02,14.6 | 33.02,14.6 33.02,19.02 33.07,19.08 RGB_LED.1 36.12,19.08 42.09,25.04 v42.09,32.36 | RGB_LED.4 33.05,14.58 33.02,14.6 | v15.17,16.26 17.82,13.61 33.02,13.61 | RGB_LED.6 33.04,11.58 33.02,11.56
  Bottom 1.016: 51.07,8.58 RGB_LED.8 | v52.76,3.63 51.07,5.32 51.07,8.58 | 51.07,8.58 51.07,12.7 | 51.07,12.7 51.07,19.78 v52.76,21.46 | v52.76,12.7 51.07,12.7
AIP1A
  Top 0.203: IC4.1 52.21,51.58 C20.2
AIP1B
  Top 0.203: IC4.2 47.53,52.38 48.95,53.8 C21.2
BLU_CATHODE
  Top 1.016: L3.2 40.33,5.54 35.8,10.08 RGB_LED.7
BLU_PWM  (via drill 0.33)
  Top 0.203: FPC.14 38.11,45.32 v38.58,45.8
  Top 0.254: R22.1 68.68,42.11 67.23,40.67 67.23,38.07 v67.54,37.77 67.84,37.46 68.99,37.46 Q3.B
  Bottom 0.254: v38.58,45.8 36.22,43.43 36.22,39.83 40.56,35.48 45.44,35.48 48.11,32.82 52.68,32.82 58.55,38.68 66.62,38.68 v67.54,37.77
CC1  (via drill 0.33)
  Top 0.203: USB-C.A5 6.17,11.66 5.97,11.86 v5.59,11.86
  Top 0.254: v8.56,15.14 R14.1
  Bottom 0.254: v5.59,11.86 6.2,11.86 8.56,14.22 v8.56,15.14
CC2
  Top 0.203: USB-C.B5 7.8,8.66 8.25,9.12 9.02,9.12 9.85,8.28 R13.1
ESP_EN_N  (via drill 0.33, 0.35)
  Top 0.203: T2.C 27.28,18.37 v27.3,18.34 R67.1 C4.2 | IC6.3 21.81,40.16 21.84,40.13 v23.65,40.13 30.05,40.13 30.66,39.52 30.66,36.86 31.65,35.86 v31.65,32.28 | v19.68,46.46 19.68,52.86 20.14,53.31 20.14,54.84 20.6,55.3 20.6,56.82 18.77,58.65 R5.2
  Top 0.305: R5.2 13.37,59.55 13.06,59.87 10.48,59.87 R6.2
  Bottom 0.203: v27.3,18.34 22.96,22.68 22.96,30.99 24.26,32.28 v31.65,32.28 | v23.65,40.13 19.68,44.1 v19.68,46.46
ESP_RX  (via drill 0.33)
  Top 0.254: R62.1 13.48,7.21 v11.99,7.21 | IC6.34 4.76,42.65 v3,42.65
  Bottom 0.254: v3,42.65 3.38,42.65 3.99,42.04 3.99,36.55 6.81,33.73 6.81,20.62 10.92,16.51 10.92,8.28 v11.99,7.21
ESP_TX  (via drill 0.33)
  Top 0.254: R63.1 13.41,4.93 v11.99,4.93 | IC6.35 v3,41.4
  Bottom 0.254: v3,41.4 3,36.25 5.89,33.35 5.89,20.24 10.01,16.13 10.01,6.91 v11.99,4.93
FLCOS_CS_N  (via drill 0.33)
  Top 0.203: FPC.3 33.53,50.82 v32.94,51.41 | IC6.26 6.73,52.83 v6.81,52.91
  Bottom 0.203: v6.81,52.91 7.44,53.54 30.81,53.54 v32.94,51.41
FLCOS_D0
  Top 0.203: IC4.18 45.03,43.81 44.81,43.59 44.11,43.59 43.69,44.02 42.37,44.02 41.67,43.32 FPC.18 27.62,43.32 25.48,45.47 25.48,49.13 23.04,51.56 IC6.12
FLCOS_D1
  Top 0.203: IC4.17 42.17,44.58 41.41,43.82 FPC.17 27.81,43.82 25.93,45.69 25.93,49.91 23.01,52.83 IC6.13
FLCOS_D2
  Top 0.203: IC4.16 41.86,46.33 39.85,44.32 FPC.16 27.99,44.32 26.39,45.92 26.39,50.78 23.06,54.1 IC6.14
FLCOS_D3  (via drill 0.33)
  Top 0.203: IC4.15 41.68,46.83 39.67,44.82 FPC.15 28.18,44.82 26.85,46.15 26.85,51.64 22.28,56.21 v22.12,56.21 | v17.7,56.82 17.73,56.79 IC6.16
  Bottom 0.203: v22.12,56.21 18.31,56.21 v17.7,56.82
FLCOS_D4  (via drill 0.33)
  Top 0.203: IC4.14 FPC.10 30,47.32 v28.52,45.85 | v6.5,40.13 IC6.36
  Bottom 0.203: v6.5,40.13 6.5,47.14 10.08,50.72 22.66,50.72 27.53,45.85 v28.52,45.85
FLCOS_D5  (via drill 0.33)
  Top 0.203: IC4.13 FPC.9 29.51,47.82 v28.52,46.84 | IC6.33 3.07,43.94 v3,43.94
  Bottom 0.203: v3,43.94 3,44.86 9.55,51.41 22.96,51.41 27.53,46.84 v28.52,46.84
FLCOS_D6  (via drill 0.33)
  Top 0.203: IC4.12 FPC.8 28.86,48.32 v28.52,47.98 | 4.82,50.27 IC6.28 6.7,50.29 v6.81,50.19
  Bottom 0.203: v6.81,50.19 8.71,52.1 23.42,52.1 27.53,47.98 v28.52,47.98
FLCOS_D7  (via drill 0.33)
  Top 0.203: IC4.11 FPC.7 28.9,48.82 v28.52,49.2 | v6.81,51.56 IC6.27
  Top 0.254: v27.53,52.48 R12.2
  Bottom 0.203: v6.81,51.56 8.03,52.78 23.8,52.78 24.1,52.48 v27.53,52.48 27.53,49.58 27.91,49.2 v28.52,49.2
FLCOS_HD  (via drill 0.33)
  Top 0.203: v49.71,45.49 49.78,45.56 IC4.25 | v40.18,41.07 39.19,41.07 38.44,41.82 FPC.21 27.06,41.82 24.1,44.78 24.1,46.69 23.04,47.75 IC6.9
  Bottom 0.203: v40.18,41.07 40.79,41.07 41.71,41.99 41.71,42.82 43.92,45.03 47.68,45.03 48.13,45.49 v49.71,45.49
FLCOS_PCLK  (via drill 0.33)
  Top 0.203: IC4.9 v40.87,49.83 | IC6.8 23.06,46.48 23.57,45.98 23.57,44.63 26.88,41.32 FPC.22
  Top 0.254: FPC.22 37.88,41.32 v38.2,41
  Bottom 0.305: v40.87,49.83 40.87,45.08 38.2,42.42 v38.2,41
FLCOS_VALID  (via drill 0.33)
  Top 0.203: v48.41,46.71 48.53,46.83 IC4.26 | v40.11,42.6 39.88,42.82 FPC.19 27.43,42.82 25.02,45.24 25.02,48.26 22.99,50.29 IC6.11
  Bottom 0.203: v40.11,42.6 40.11,43.21 43.89,46.99 48.13,46.99 v48.41,46.71
FLCOS_VD  (via drill 0.33)
  Top 0.203: v39.42,41.83 38.93,42.32 FPC.20 27.25,42.32 24.56,45.01 24.56,47.48 23.01,49.02 IC6.10 | v47.35,46.02 48.03,45.34 IC4.24
  Bottom 0.203: v47.35,46.02 43.92,46.02 41.02,43.13 41.02,42.29 40.56,41.83 v39.42,41.83
GND  (via drill 0.33)
  Top 0.203: v50.24,54.86 C14.1 | C15.1 v40.87,59.21 | R8.1 v58.93,49.38 | C17.1 57.76,46.86 v57.78,46.84 | C16.1 57.76,44.65 v57.78,44.63 | IC4.3 47.03,52.72 v46.81,52.93 | IC4.7 45.03,52.51 v44.6,52.93 | FPC.2 38.47,51.32 v38.51,51.36 | C22.1 40.21,52.58 v40.18,52.55 | C56.2 v28.3,36.65 28.32,36.65 | R12.1 v27.53,59.49 | IC9.4 v60.26,8.59 | IC8.4 v60.26,17.65 | IC7.4 v60.26,26.42 | IC4.31 47.25,49.33 v47.12,49.2 | C4.1 28.31,14.67 v27.76,15.21
  Top 0.254: IC5.1 17.57,8.97 | IC6.1 21.76,37.57 | IC6.38 4.82,37.57 v6.65,37.57 | C53.1 v19.95,4.32 C50.1 | C52.1 28.49,11.89 v28.45,11.94 | C13.2 36.41,35.68 v36.37,35.71 | C49.- v15.17,9.27 | C3.2 v53.97,37.62 | C18.2 46.37,38.98 v46.35,38.99 | Q1.E 57.37,34.31 v57.33,34.26 | Q3.E 69.06,35.57 v69.06,34.42 | Q2.E 63.24,34.3 v63.27,34.26 | R14.2 12.45,15.14 v12.67,15.37 | R13.2 8.42,4.53 v8.25,4.7
  Top 0.305: C23.2 v37.36,59.56 | J1.SH1 v4.41,32.44 | J1.SH2 v13.41,32.44 | J1.SH4 v4.41,19.18 | J1.SH3 v13.41,19.18 | IC2.2 v51.05,39.98 | R15.1 v57.78,9.8 | R3.1 v57.78,18.87 | R1.1 v57.78,27.64
  Top 0.406: 17.57,8.97 v16.54,8.97 | v21.74,36.35 21.74,37.55 IC6.1 | C27.2 v61.98,14.32 61.6,13.94 IC8.2 | IC7.2 61.49,22.73 v61.98,23.22 63.32,23.22 C1.2 | C2.2 63.18,5.31 v61.98,5.31 61.57,4.9 IC9.2 | IC7.4 60.26,25.46 | C47.2 17.11,28.61 16.61,29.11 J1.P6 v13.97,29.11
  Top 0.508: C55.- 24.8,33.2 v26.62,33.2 | IC1.1 v21.92,30.68
  other vias: 8.64,45.47 3,46.46 2.92,50.95 56.95,6.07 58.01,6.07 58.01,5 56.95,5 56.95,23.9 58.01,23.9 58.01,22.83 56.95,22.83 56.95,15.06 58.01,15.06 58.01,14.07 56.95,14.07 14.27,45.16 12.9,45.16 15.65,45.16 14.27,46.46 12.9,46.46 15.65,46.46 14.27,43.87 12.9,43.87 15.65,43.87 24.64,41.43 8.64,41.81
  pour Top (rank 2): 0.03,62.08 73.86,62.08 73.86,0.05 0.03,0.05
  pour Bottom (rank 2): 0.03,62.08 73.86,62.08 73.86,0.05 0.03,0.05
GRN_CATHODE
  Top 1.016: L2.2 42.39,14.55 40.24,14.55 38.71,16.08 36.91,16.08 | RGB_LED.3 36.91,16.08 | RGB_LED.2 36.37,17.58 36.91,17.04 36.91,16.08
GRN_PWM  (via drill 0.33)
  Top 0.203: FPC.13 v35.31,45.82
  Top 0.254: Q2.B 62.05,37.35 v61.75,37.66 61.44,37.96 61.44,40.67 62.89,42.11 R21.1
  Bottom 0.254: v35.31,45.82 35.31,39.29 40.11,34.49 44.91,34.49 47.5,31.9 53.44,31.9 59.19,37.66 v61.75,37.66
N$1  (via drill 0.33)
  Top 0.254: IC7.6 53.42,24 v52.83,24.59 | R17.1 59.55,36.42 | 59.55,36.42 Q1.C | 59.55,36.42 59.55,34.79 v59.61,34.72
  Bottom 0.254: v52.83,24.59 52.83,27.94 v59.61,34.72
N$2
  Top 0.406: IC7.3 61.39,24 62.57,25.18 R2.2
N$3
  Top 0.406: IC7.5 R1.2
N$4
  Top 0.406: IC7.1 63.28,21.46 C1.1
N$5
  Top 0.406: IC7.7 53.16,22.73 51.08,24.82 | 51.08,24.82 D1.A | L1.1 49.63,23.37 51.08,24.82
N$6
  Top 0.406: IC9.3 61.54,6.17 62.73,7.35 R16.2
N$7
  Top 0.406: IC9.5 R15.2
N$8
  Top 0.406: IC9.1 63.21,3.63 C2.1
N$9
  Top 0.406: IC9.7 53.16,4.9 51.08,6.98 | 51.08,6.98 D3.A | L3.1 49.63,5.54 51.08,6.98
N$10
  Top 0.305: IC2.4 52.75,41.13 53.2,40.68 C3.1
N$11  (via drill 0.33)
  Top 0.254: IC8.6 53.44,15.21 v52.83,15.82 | R18.1 65.42,36.42 Q2.C 65.44,34.84 v65.56,34.72
  Bottom 0.254: v52.83,15.82 52.83,18.64 54.43,20.24 61.9,20.24 65.56,23.9 v65.56,34.72
N$12  (via drill 0.33)
  Top 0.254: IC9.6 53.49,6.17 v52.83,6.83 | R19.1 71.21,36.57 Q3.C 71.23,34.99 v71.35,34.87
  Bottom 0.254: v71.35,34.87 67.39,30.91 67.39,23.6 63.42,19.63 63.42,13.54 58.24,8.36 54.36,8.36 v52.83,6.83
N$15
  Top 0.152: C21.1 53.99,54.37 52.7,55.65 R10.2
  Top 0.203: R9.2 C21.1
N$17
  Top 0.203: R8.2 R7.2 C20.1
N$20
  Top 0.406: R7.1 62.23,51.59 63.39,50.43 CVBS.TIP
N$21
  Top 0.406: R9.1 62.23,53.8 65.86,57.43 CVBS.RING2
N$24
  Top 0.406: IC8.3 61.44,15.21 62.57,16.35 R4.2
N$25
  Top 0.406: 54.67,16.51 IC8.5 R3.2
N$26
  Top 0.406: IC8.1 63.28,12.67 C27.1
N$27
  Top 0.406: IC8.7 53.03,13.94 51.08,15.9 | 51.08,15.9 D2.A | L2.1 49.76,14.58 51.08,15.9
N$67
  Top 0.254: IC5.2 18.87,7.92 18.14,7.19 R62.2
N$70
  Top 0.254: R63.2 16.71,6.38 18.54,6.38 20.14,7.98 IC5.3
N$71
  Top 0.254: T1.B 21.56,19.04 R64.2
N$77
  Top 0.254: R65.2 23.36,21 T2.B
N$78  (via drill 0.33)
  Top 0.254: R64.1 23.32,19.07 25.04,19.07 T2.E 25.07,17.83 v25.09,17.81 | IC5.14 20.14,15.52 20.9,16.28 v20.9,16.89
  Bottom 0.254: v25.09,17.81 25.09,17.12 23.65,15.67 21.67,15.67 20.9,16.43 v20.9,16.89
N$79  (via drill 0.33)
  Top 0.254: v21.59,22.68 21.58,22.67 R65.1 21.44,20.94 T1.E | IC5.13 21.41,15.42 22.35,16.36 v22.35,16.89
  Bottom 0.254: v21.59,22.68 21.59,17.65 v22.35,16.89
N$80
  Top 0.254: IC5.4 21.41,7.39 21.65,7.15 C50.2
N$81
  Top 0.254: IC5.7 25.22,8 25.93,7.29 25.93,5.69 24.39,4.15 X2.3 23.86,4.15 22.75,3.04 C53.2
N$82
  Top 0.254: IC5.8 26.49,8.03 26.92,7.59 27.23,7.59 28.27,6.55 X2.1 28.49,6.57 C52.2
RED_CATHODE  (via drill 0.33)
  Top 1.016: L1.2 41.02,23.37 39.57,21.92 v39.57,19.48
  Bottom 1.016: RGB_LED.5 36.44,13.08 39.57,16.21 v39.57,19.48
RED_PWM  (via drill 0.33)
  Top 0.203: FPC.12 37.69,46.32 37.97,46.61 39.52,46.61 v39.8,46.33
  Top 0.254: Q1.B 56.3,37.35 v55.88,37.77 55.5,38.15 55.5,40.67 56.95,42.11 R20.1
  Bottom 0.254: v39.8,46.33 39.8,45.54 37.13,42.88 37.13,40.36 41.02,36.47 46.05,36.47 48.79,33.73 51.84,33.73 v55.88,37.77
REFM
  Top 0.203: C17.2 54.57,47.09 53.07,47.09 C19.1 51.33,48.83 IC4.30
REFP
  Top 0.203: IC4.29 50.75,48.33 51.76,47.32 51.76,45.8 52.01,45.56 C19.2 53.81,44.65 C16.2
SD_CS_N
  Top 0.254: IC6.29 3.58,49.02 2.01,47.45 2.01,29.39 6.96,24.43 6.96,22.76 7.57,22.15 11.99,22.15 14.55,24.71 J1.P2
SPI_MISO  (via drill 0.33)
  Top 0.203: IC6.31 v7.65,46.48 | J1.P7 16.85,30.21 v17.17,30.53 | v28.52,51.64 30.34,49.82 FPC.5 | v29.13,37.54 29.67,37.01 R11.1 27.7,34.12 v27.69,34.11
  Bottom 0.203: v7.65,46.48 7.65,37.16 8.56,36.25 13.89,36.25 17.17,32.97 v17.17,30.53 20.07,30.53 23.04,33.5 25.17,33.5 25.78,34.11 v27.69,34.11 | v28.52,51.64 31.27,51.64 32.03,50.88 32.03,50.04 31.19,49.2 31.19,42.57 28.37,39.75 28.37,38.3 v29.13,37.54
SPI_MOSI  (via drill 0.33)
  Top 0.203: v28.52,50.42 29.62,49.32 FPC.6 | IC6.37 v8.56,38.86 v8.56,34.04 | v13.97,25.81 J1.P3
  Bottom 0.203: v28.52,50.42 29.13,50.42 29.59,49.96 29.59,44.4 24.06,38.86 v8.56,38.86 | v8.56,34.04 11.68,34.04 12.52,33.2 12.52,27.25 v13.97,25.81
SPI_SCLK  (via drill 0.33)
  Top 0.203: v30.81,50.65 31.14,50.32 FPC.4
  Top 0.305: IC6.30 8.02,47.75 9.7,46.08 v9.7,37.77 v9.7,35.18 | v13.97,28.02 13.98,28.01 J1.P5
  Bottom 0.203: v9.7,37.77 24.41,37.77 30.51,43.87 30.51,50.34 v30.81,50.65
  Bottom 0.305: v9.7,35.18 12.83,35.18 15.42,32.59 15.42,29.46 v13.97,28.02
TVP_FID  (via drill 0.33)
  Top 0.203: IC4.23 47.53,43.83 47.73,43.64 48.41,43.64 v49.25,42.8 | IC6.6 20.37,43.94 19.76,43.33 19.76,40.74 17.7,38.68 v17.7,35.56 | v49.94,34.72 49.78,34.87 48.64,34.87 44.45,30.68 38.66,30.68 35,34.34 v33.32,34.34
  Bottom 0.203: v17.7,35.56 18.47,34.8 24.64,34.8 24.87,35.03 32.64,35.03 v33.32,34.34 | v49.25,42.8 49.25,35.41 v49.94,34.72
TVP_FL_RST_N  (via drill 0.33)
  Top 0.203: IC4.8 42.56,51.58 v42.54,51.56 | IC6.25 4.79,55.34 v4.9,55.45 | FPC.23 35.61,40.82 35.08,40.28 v32.79,40.28 | v29.44,54.69 30.35,55.6 34.77,55.6 v36.68,53.7
  Top 0.254: IC6.25 3.41,54.1 1.09,51.79 1.09,28.55 6.04,23.6 6.04,22.15 6.96,21.23 v13.44,21.23 | v17.63,21.23 17.63,20.01 T1.C 17.64,17.07 R23.2
  Bottom 0.203: v42.54,51.56 40.41,53.7 v36.68,53.7 35.61,52.63 35.61,49.89 33.02,47.29 33.02,40.51 v32.79,40.28 | v29.44,54.69 5.66,54.69 v4.9,55.45
  Bottom 0.254: v17.63,21.23 v13.44,21.23
TVP_INT  (via drill 0.33)
  Top 0.203: IC6.7 20.27,45.21 18.77,43.71 18.77,41.12 16.48,38.84 v16.48,36.7 | IC4.27 50.81,47.33 51,47.14 v51,42.8 | v51,35.71 48.34,35.71 43.99,31.37 39.12,31.37 34.85,35.64 v33.32,35.64
  Bottom 0.203: v16.48,36.7 18.24,36.7 19.38,35.56 24.1,35.56 24.33,35.79 33.17,35.79 v33.32,35.64 | v51,42.8 50.09,41.88 50.09,36.63 v51,35.71
TVP_SCL  (via drill 0.33)
  Top 0.203: IC4.21 46.53,42.93 v46.66,42.8 | IC6.23 8.84,56.88 v9.02,57.05 10.07,57.05 R5.1
  Bottom 0.203: v46.66,42.8 46.66,43.03 48.18,44.55 50.24,44.55 50.77,45.08 50.77,46.91 52.3,48.44 52.3,50.42 48.95,53.77 43.69,53.77 39.73,57.73 23.04,57.73 22.58,58.19 10.16,58.19 v9.02,57.05
TVP_SDA  (via drill 0.33)
  Top 0.203: IC4.22 47.03,43.65 v47.88,42.8 | IC6.24 7.57,56.98 v7.57,57.05 7.57,58.64 R6.1
  Bottom 0.203: v47.88,42.8 47.88,43.1 48.64,43.87 50.62,43.87 51.54,44.78 51.54,46.53 53.06,48.06 53.06,50.72 49.25,54.53 43.99,54.53 40.03,58.5 23.49,58.5 23.04,58.95 9.47,58.95 v7.57,57.05
USB_D+  (via drill 0.33)
  Top 0.254: 8.18,10.69 7.92,10.69 7.9,10.66 USB-C.A6 | 8.18,10.69 12.47,10.69 v12.65,10.52 | IC5.5 22.68,9.91 22.86,10.08 v22.86,10.64 | USB-C.B6 7.96,9.66 8.18,9.88 8.18,10.69
  Bottom 0.254: v12.65,10.52 12.83,10.69 15.9,10.69 17.07,11.86 22.58,11.86 23.04,11.4 23.04,10.82 v22.86,10.64
USB_D-  (via drill 0.33)
  Top 0.254: IC5.6 23.95,9.93 23.77,10.11 v23.77,10.64 | v12.65,11.4 12.39,11.15 7.92,11.15 7.91,11.16 USB-C.B7 6.26,11.16 6.04,10.95 6.04,10.34 6.22,10.16 USB-C.A7
  Bottom 0.254: v12.65,11.4 12.88,11.18 15.73,11.18 16.9,12.34 22.82,12.34 23.57,11.6 23.57,10.85 v23.77,10.64
XTAL1
  Top 0.203: IC4.5 46.03,56.87 47.43,58.27 X1.3 48.07,57.92 C14.2
XTAL2
  Top 0.203: C15.2 41.03,56.06 43.13,56.06 X1.1 43.57,55.87 45.53,53.91 IC4.6

### Text on the board
tPlace: ElectronAsh, April 2023 | FLCOS Mini Projector v1.1 | github.com/ElectronAsh/FLCOS-Mini-Projector-ESP32